# EAGLE schematic teensy3.6-cs42448 (EAGLE 9.3.2)

## Sheet 1 of 2
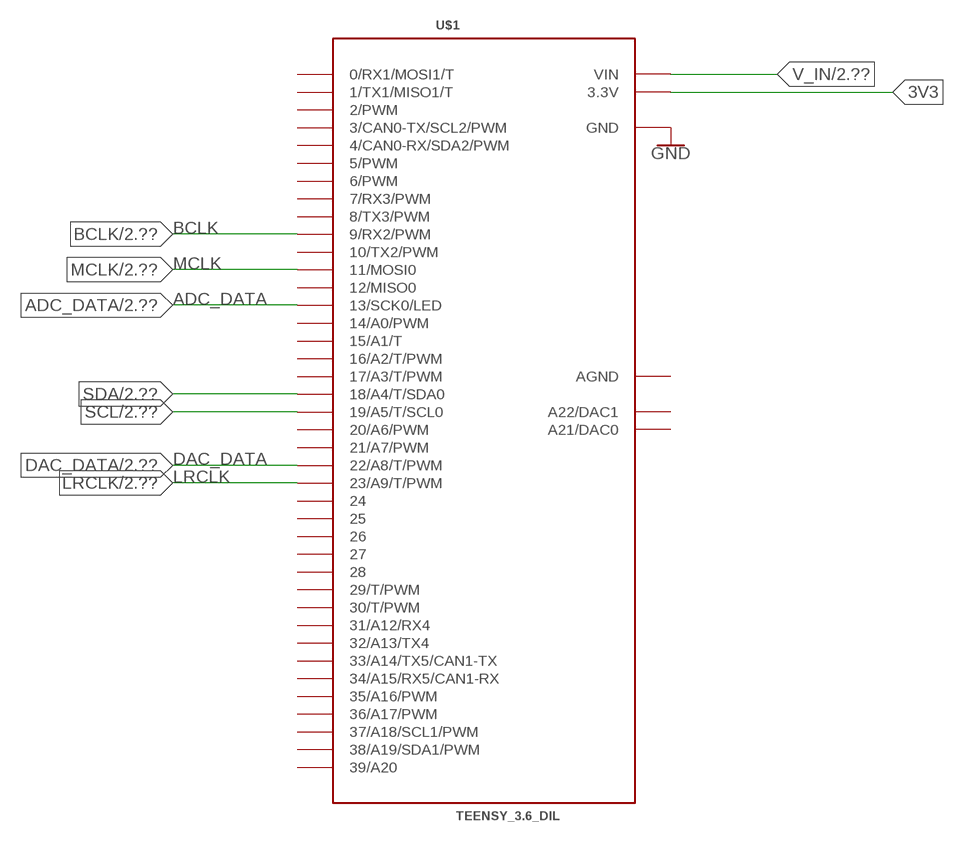
[diagram p0: schematic, sheet 1]

### Parts
U$1  TEENSY_3.6_DIL  [TEENSY_3.6_DIL]

### Nets
3V3: U$1.3.3V U$1.3.3V3(3.3V) ; also sheet 2
ADC_DATA: U$1.13(13/SCK0/LED) ; also sheet 2
BCLK: U$1.9(9/RX2/PWM) ; also sheet 2
DAC_DATA: U$1.22/A8(22/A8/T/PWM) ; also sheet 2
GND: U$1.GND U$1.GND1(GND) ; also sheet 2
LRCLK: U$1.23/A9(23/A9/T/PWM) ; also sheet 2
MCLK: U$1.11(11/MOSI0) ; also sheet 2
SCL: U$1.19/A5(19/A5/T/SCL0) ; also sheet 2
SDA: U$1.18/A4(18/A4/T/SDA0) ; also sheet 2
V_IN: U$1.VIN ; also sheet 2
Unconnected: U$1.0(0/RX1/MOSI1/T) U$1.1(1/TX1/MISO1/T) U$1.2(2/PWM) U$1.3(3/CAN0-TX/SCL2/PWM) U$1.4(4/CAN0-RX/SDA2/PWM) U$1.5(5/PWM) U$1.6(6/PWM) U$1.7(7/RX3/PWM) U$1.8(8/TX3/PWM) U$1.10(10/TX2/PWM) U$1.12(12/MISO0) U$1.14/A0(14/A0/PWM) U$1.15/A1(15/A1/T) U$1.16/A2(16/A2/T/PWM) U$1.17/A3(17/A3/T/PWM) U$1.20/A6(20/A6/PWM) U$1.21/A7(21/A7/PWM) U$1.24 U$1.25 U$1.26 U$1.27 U$1.28 U$1.29(29/T/PWM) U$1.30(30/T/PWM) U$1.31/A12(31/A12/RX4) U$1.32/A13(32/A13/TX4) U$1.33/A14(33/A14/TX5/CAN1-TX) U$1.34/A15(34/A15/RX5/CAN1-RX) U$1.35/A16(35/A16/PWM) U$1.36/A17(36/A17/PWM) U$1.37/A18(37/A18/SCL1/PWM) U$1.38/A19(38/A19/SDA1/PWM) U$1.39/A20 U$1.A21(A21/DAC0) U$1.A22(A22/DAC1)

## Sheet 2 of 2
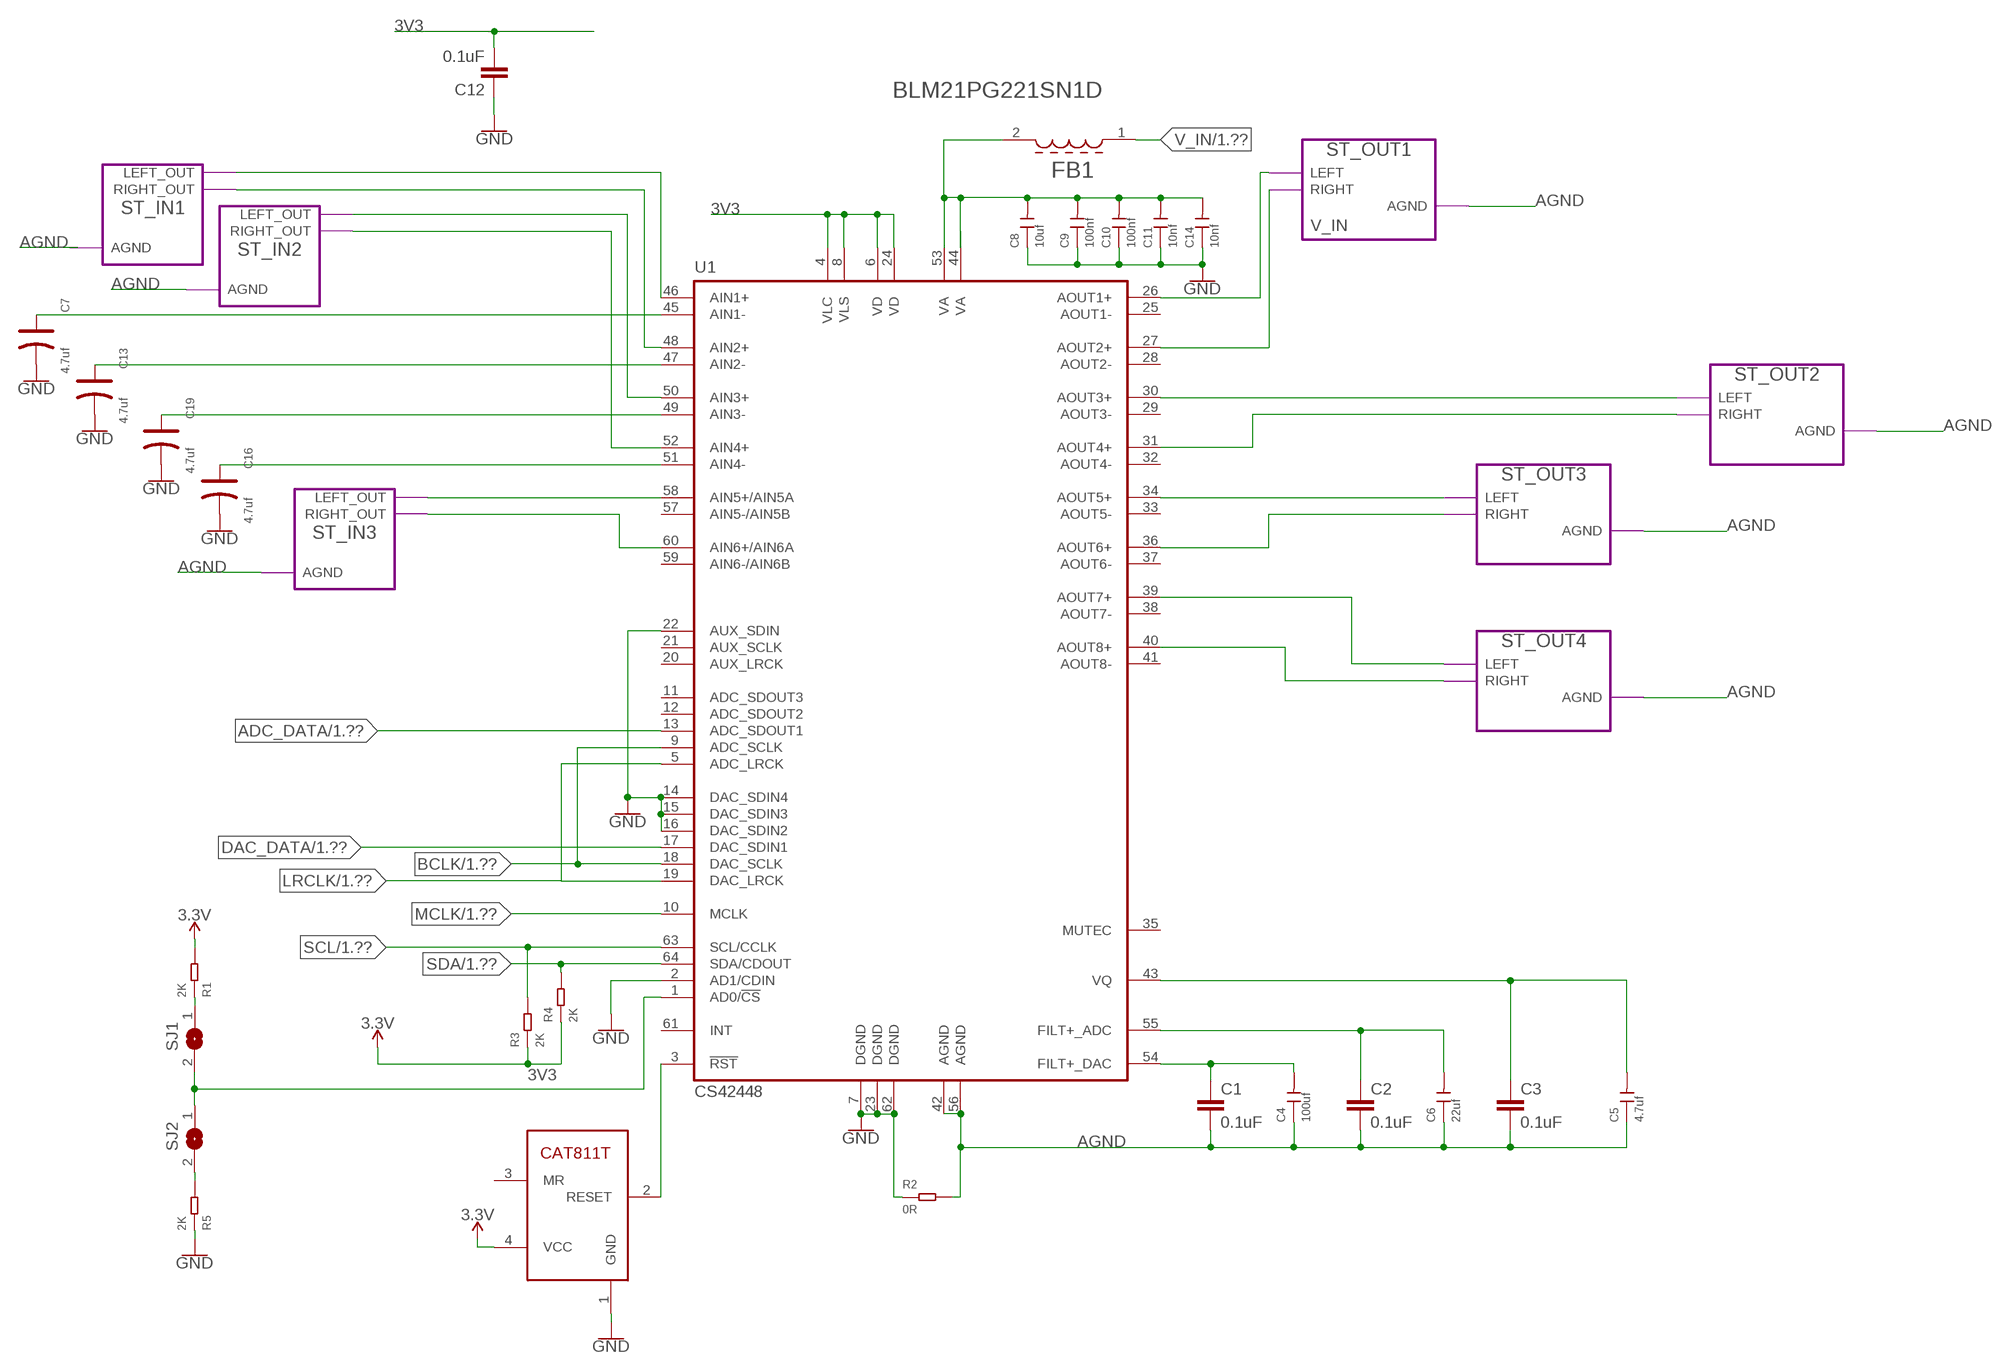
[diagram p1: schematic, sheet 2]

### Parts
C1  0.1uF  0.1UF-0603-25V-5%  [0603]
C2  0.1uF  0.1UF-0603-25V-5%  [0603]
C3  0.1uF  0.1UF-0603-25V-5%  [0603]
C4  100uf  CERAMIC-100UF-6.3V-20%-X5R(1206)  [C1206]
C5  4.7uf  CERAMIC-4.7UF-25V-10%-X5R(0805)  [C0805]
C6  22uf  CERAMIC-22UF-6.3V-20%-X5R(0805)  [C0805]
C7  4.7uf  TANTALUM-SMD-4.7UF-16V(AVX-A)  [AVX-A]
C8  10uf  CERAMIC-10UF-25V-10%-X5R(0805)  [C0805]
C9  100nf  CERAMIC-100NF-50V-10%-X7R(0805)  [C0805]
C10  100nf  CERAMIC-100NF-50V-10%-X7R(0805)  [C0805]
C11  10nf  CERAMIC-10NF-50V-5%-X7R(0805)  [C0805]
C12  0.1uF  0.1UF-0603-25V-5%  [0603]
C13  4.7uf  TANTALUM-SMD-4.7UF-16V(AVX-A)  [AVX-A]
C14  10nf  CERAMIC-10NF-50V-5%-X7R(0805)  [C0805]
C16  4.7uf  TANTALUM-SMD-4.7UF-16V(AVX-A)  [AVX-A]
C19  4.7uf  TANTALUM-SMD-4.7UF-16V(AVX-A)  [AVX-A]
FB1  MURATA_BLM21PG221SN1DMURATA_BLM21PG221SN1D_0_1  [MURATA_BLM21PG221SN1D_1]
R1  2K  SMD-RES-2K-5%-1/10W(0603)  [R0603]
R2  0R  ZERO-OHM-LINK  [R0805]
R3  2K  SMD-RES-2K-5%-1/10W(0603)  [R0603]
R4  2K  SMD-RES-2K-5%-1/10W(0603)  [R0603]
R5  2K  SMD-RES-2K-5%-1/10W(0603)  [R0603]
SJ1  SJ  [SJ]
SJ2  SJ  [SJ]
U1  CS42448  [LQFP64L]
U$2  CAT811T  [SOT143]

### Module instances
ST_IN1 = STEREO_IN
ST_IN2 = STEREO_IN
ST_IN3 = STEREO_IN
ST_OUT1 = STEREO_OUT
ST_OUT2 = STEREO_OUT
ST_OUT3 = STEREO_OUT
ST_OUT4 = STEREO_OUT

### Nets
3.3V: R1.2 U$2.4(VCC)
3V3: C12.2 R3.1 R4.1 U1.4(VLC) U1.6(VD) U1.8(VLS) U1.24(VD) ; supply symbol labelled 3.3V ; also sheet 1
ADC_DATA: U1.13(ADC_SDOUT1) ; also sheet 1
AGND: C1.2 C2.2 C3.2 C4.1 C5.1 C6.1 R2.2 U1.42(AGND) U1.56(AGND) ; port ST_OUT1.AGND ST_IN2.AGND ST_IN3.AGND ST_OUT2.AGND ST_OUT3.AGND ST_OUT4.AGND
BCLK: U1.9(ADC_SCLK) U1.18(DAC_SCLK) ; also sheet 1
DAC_DATA: U1.17(DAC_SDIN1) ; also sheet 1
GND: C7.- C8.1 C9.1 C10.1 C11.1 C12.1 C13.- C14.1 C16.- C19.- R2.1 R5.1 U1.2(AD1/CDIN) U1.7(DGND) U1.14(DAC_SDIN4) U1.15(DAC_SDIN3) U1.16(DAC_SDIN2) U1.22(AUX_SDIN) U1.23(DGND) U1.62(DGND) U$2.1(GND) ; also sheet 1
LRCLK: U1.5(ADC_LRCK) U1.19(DAC_LRCK) ; also sheet 1
MCLK: U1.10(MCLK) ; also sheet 1
N$1: U1.46(AIN1+) ; port ST_IN1.LEFT_OUT
N$2: C1.1 C4.2 U1.54(FILT+_DAC)
N$3: C2.1 C6.2 U1.55(FILT+_ADC)
N$4: C3.1 C5.2 U1.43(VQ)
N$5: U1.48(AIN2+) ; port ST_IN1.RIGHT_OUT
N$6: C8.2 C9.2 C10.2 C11.2 C14.2 FB1.2 U1.44(VA) U1.53(VA)
N$7: U1.58(AIN5+/AIN5A) ; port ST_IN3.LEFT_OUT
N$8: C7.+ U1.45(AIN1-)
N$9: C13.+ U1.47(AIN2-)
N$10: U1.60(AIN6+/AIN6A) ; port ST_IN3.RIGHT_OUT
N$11: SJ1.2 SJ2.1 U1.1(AD0/!CS!)
N$12: R1.1 SJ1.1
N$13: U1.52(AIN4+) ; port ST_IN2.RIGHT_OUT
N$14: U1.50(AIN3+) ; port ST_IN2.LEFT_OUT
N$15: U1.26(AOUT1+) ; port ST_OUT1.LEFT
N$16: C16.+ U1.51(AIN4-)
N$17: U1.27(AOUT2+) ; port ST_OUT1.RIGHT
N$18: U1.30(AOUT3+) ; port ST_OUT2.LEFT
N$19: U1.31(AOUT4+) ; port ST_OUT2.RIGHT
N$20: C19.+ U1.49(AIN3-)
N$21: U1.34(AOUT5+) ; port ST_OUT3.LEFT
N$22: U1.36(AOUT6+) ; port ST_OUT3.RIGHT
N$23: U1.39(AOUT7+) ; port ST_OUT4.LEFT
N$24: U1.40(AOUT8+) ; port ST_OUT4.RIGHT
N$25: R5.2 SJ2.2
N$26: U1.3(!RST!) U$2.2(RESET)
SCL: R3.2 U1.63(SCL/CCLK) ; also sheet 1
SDA: R4.2 U1.64(SDA/CDOUT) ; also sheet 1
V_IN: FB1.1 ; also sheet 1
Unconnected: U1.11(ADC_SDOUT3) U1.12(ADC_SDOUT2) U1.20(AUX_LRCK) U1.21(AUX_SCLK) U1.25(AOUT1-) U1.28(AOUT2-) U1.29(AOUT3-) U1.32(AOUT4-) U1.33(AOUT5-) U1.35(MUTEC) U1.37(AOUT6-) U1.38(AOUT7-) U1.41(AOUT8-) U1.57(AIN5-/AIN5B) U1.59(AIN6-/AIN6B) U1.61(INT) U$2.3(MR)

## Power pins joined to a net without a drawn wire
AGND: U$1.AGND

## Library data of the parts
C1-C3 C12 = SparkFun-Capacitors:0.1UF: 0.1µF ceramic capacitors A capacitor is a passive two-terminal electrical component used to store electrical energy temporarily in an electric field.; PROD_ID: CAP-08604
C4 = Seeed-Capacitor:CERAMIC-100UF-6.3V-20%-X5R(1206): 302010183; MPN: GRM31CR60J107ME39L
C5 = Seeed-Capacitor:CERAMIC-4.7UF-25V-10%-X5R(0805): 302010146; MPN: CC0805KKX5R8BB475
C6 = Seeed-Capacitor:CERAMIC-22UF-6.3V-20%-X5R(0805): 302010171; MPN: CC0805MKX5R5BB226
C7 C13 C16 C19 = Seeed-Capacitor:TANTALUM-SMD-4.7UF-16V(AVX-A): 302020006; MPN: TAJA475*016#NJ
C8 = Seeed-Capacitor:CERAMIC-10UF-25V-10%-X5R(0805): 302010178; MPN: CC0805KKX5R8BB106
C9 C10 = Seeed-Capacitor:CERAMIC-100NF-50V-10%-X7R(0805): 302010165; MPN: CC0805KRX7R9BB104
C11 C14 = Seeed-Capacitor:CERAMIC-10NF-50V-5%-X7R(0805): 302010175; MPN: CC0805JRX7R9BB103
FB1 = Murata - BLM21PG221SN1D:MURATA_BLM21PG221SN1D: MURA-FB-2; CIIVA_IDS: 886556; COMPONENT_LINK_1_DESCRIPTION: Manufacturer URL; COMPONENT_LINK_1_URL: http://www.murata.com/; COMPONENT_LINK_3_DESCRIPTION: Package Specification; COMPONENT_LINK_3_URL: http://www.murata.com/products/catalog/pdf/c31e.pdf; DATASHEET: http://www.murata.com/products/catalog/pdf/c31e.pdf; DATASHEET_VERSION: 08/2013; DC_RESISTANCE: 0.045 Ohm Max.; FOOTPRINT_VARIANT_NAME_0: MURA-BLM21-B20-CHIP-2_V2; FOOTPRINT_VARIANT_NAME_1: MURA-BLM21-B20-CHIP-2_V1; IMPEDANCE_AT_100_MHZ: 220 Ohm +/- 25%; IMPORTED: yes; IMPORTED_FROM: vault; IMPORT_TS: 1521843617; MF: Murata; MOUNTING_TECHNOLOGY: Surface Mount; MPN: BLM21PG221SN1D; OPERATING_TEMPERATURE_RANGE: -55 to 125 degC; PACKAGE: BLM21_H1050-2; PACKAGE_DESCRIPTION: 2-Pin Chip, Body 2 x 1.25 mm; PACKING: Tape and Reel; PREFIX: FB; RATED_CURRENT: 2000 mA; RELEASE_DATE: 1390571351; VAULT_GUID: D6414E20-2109-4A17-A638-53E055BFA7B6; VAULT_REVISION: E9EAA9AD-C8DD-4E35-B9CB-2397DCCBD7BA
R1 R3-R5 = OPL_Resistor:SMD-RES-2K-5%-1/10W(0603): 301010113; MPN: RC0603JR-072KL
R2 = zero-ohm-resistor:ZERO-OHM-LINK: 301010264; MPN: RL0805JR-070R1L; VALUE: 0.1R
SJ1 SJ2 = jumper:SJ: SMD solder JUMPER
U1 = cirrus:CS42448: CODEC 6-In, 8-Out, 108 dB, 192 kHz
U$1 = Teensy_3_and_LC_Series_Boards_v1.4:TEENSY_3.6_DIL: Teensy 3.6 DIL Package
U$2 = CAT811T:CAT811T

## Module STEREO_IN
Ports: LEFT_OUT(out) RIGHT_OUT(out) AGND(out)
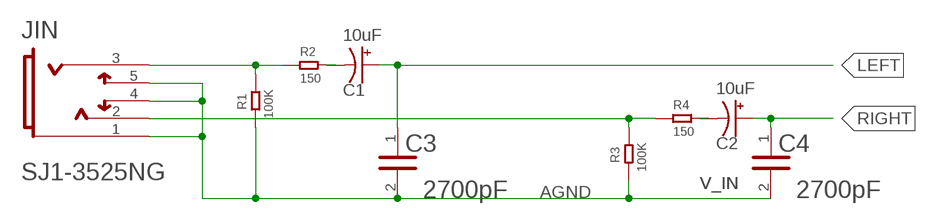
[diagram p2: schematic, module STEREO_IN, sheet 1]

### Parts
C1  10uF  10UF-POLAR-0603-6.3V-20%(TANT)  [0603-POLAR]
C2  10uF  10UF-POLAR-0603-6.3V-20%(TANT)  [0603-POLAR]
C3  MURATA_GRM2165C1H272JA01DMURATA_GRM2165C1H272JA01D_0_1  [MURATA_GRM2165C1H272JA01D_1]
C4  MURATA_GRM2165C1H272JA01DMURATA_GRM2165C1H272JA01D_0_1  [MURATA_GRM2165C1H272JA01D_1]
JIN  CUI_SJ1-3525NGCUI_SJ1-3525NG_0_0  [CUI_SJ1-3525NG_0]
R1  100K  SMD-RES-100K-1%-1/8W(0805)  [R0805]
R2  150  SMD-RES-150R-1%-1/8W(0805)  [R0805]
R3  100K  SMD-RES-100K-1%-1/8W(0805)  [R0805]
R4  150  SMD-RES-150R-1%-1/8W(0805)  [R0805]

### Nets
AGND: C3.2 C4.2 JIN.1(SLEEVE) JIN.4(TIP_SWITCH) JIN.5(RING_SWITCH) R1.1 R3.1
LEFT: C1.+ C3.1
N$1: JIN.3(RING) R1.2 R2.1
N$7: C1.- R2.2
N$10: JIN.2(TIP) R3.2 R4.1
N$11: C2.- R4.2
RIGHT: C2.+ C4.1

### Library data of the parts
C1 C2 = SparkFun-Capacitors:10UF-POLAR: 10.0µF polarized capacitors A capacitor is a passive two-terminal electrical component used to store electrical energy temporarily in an electric field.; PROD_ID: CAP-13210
C3 C4 = Murata - GRM2165C1H272JA01D:MURATA_GRM2165C1H272JA01D: CAP Ceramic 2700pF 5% C0G 50V 0805 SMD; CAPACITANCE: 2700pF; CENTROID_NOT_SPECIFIED: No; DATASHEET: http://search.murata.co.jp/Ceramy/image/img/A01X/G101/ENG/GRM21BC71H475KE11-01.pdf; DEVICE_CLASS_L1: Passive Components; DEVICE_CLASS_L2: Capacitors; DEVICE_CLASS_L3: Ceramic Capacitors; DIGIKEY_DESCRIPTION: CAP CER 2700PF 50V C0G/NP0 0805; DIGIKEY_PART_NUMBER: 490-1630-2-ND; FOOTPRINT_PARAMETERS_0: {"fp_type":"chip_cap","params":{"L":{"nom":2000000,"long name":"Length","min":1800000,"max":2200000,"short name":"L","type":"measurement"},"W":{"nom":1250000,"long name":"Width","min":1049999,"max":1450000,"short name":"W","type":"measurement"},"t":{"nom":1250000,"long name":"Height","min":1049999,"max":1450000,"short name":"t","type":"measurement"},"b":{"nom":false,"long name":"Terminal width","min":200000,"max":700000,"short name":"b","type":"measurement"},"P":{"default":"false","long name":"Polarized","type":"multichoice","short name":"P"},"offset x":{"nom":0,"long name":"X Center offset","min":null,"max":null,"short name":"offset x","type":"measurement"},"offset y":{"nom":0,"long name":"Y Center offset","min":null,"max":null,"short name":"offset y","type":"measurement"},"POL":{"default":"No","long name":"Pin 1 polarity marker","type":"multichoice","short name":"POL"},"LS":{"long name":"Land shape","type":"fixed","short name":"LS","value":"Rectangle"},"solder toe":{"nom":550000,"long name":"Solder fillet (toe)","min":null,"max":null,"short name":"solder toe","type":"fixedmeasurement"},"solder heel":{"nom":-50000,"long name":"Solder fillet (heel)","min":null,"max":null,"short name":"solder heel","type":"fixedmeasurement"},"solder side":{"nom":50000,"long name":"Solder fillet (side)","min":null,"max":null,"short name":"solder side","type":"fixedmeasurement"},"courtyard":{"nom":500000,"long name":"Courtyard","min":null,"max":null,"short name":"courtyard","type":"fixedmeasurement"},"SF":{"default":"A (>= 1608 metric)","long name":"Packing level","type":"multichoiceparent","short name":"SF","help":"http://support.upverter.com/customer/portal/articles/978783-what-is-a-footprint-packing-level","children":["solder toe","solder heel","solder side","courtyard"]}}}; FOOTPRINT_PARAMETERS_1: {"fp_type":"chip_cap","params":{"L":{"nom":2000000,"long name":"Length","min":1800000,"max":2200000,"short name":"L","type":"measurement"},"W":{"nom":1250000,"long name":"Width","min":1049999,"max":1450000,"short name":"W","type":"measurement"},"t":{"nom":1250000,"long name":"Height","min":1049999,"max":1450000,"short name":"t","type":"measurement"},"b":{"nom":false,"long name":"Terminal width","min":200000,"max":700000,"short name":"b","type":"measurement"},"P":{"default":"false","long name":"Polarized","type":"multichoice","short name":"P"},"offset x":{"nom":0,"long name":"X Center offset","min":null,"max":null,"short name":"offset x","type":"measurement"},"offset y":{"nom":0,"long name":"Y Center offset","min":null,"max":null,"short name":"offset y","type":"measurement"},"POL":{"default":"No","long name":"Pin 1 polarity marker","type":"multichoice","short name":"POL"},"LS":{"long name":"Land shape","type":"fixed","short name":"LS","value":"Rectangle"},"solder toe":{"nom":350000,"long name":"Solder fillet (toe)","min":null,"max":null,"short name":"solder toe","type":"fixedmeasurement"},"solder heel":{"nom":-50000,"long name":"Solder fillet (heel)","min":null,"max":null,"short name":"solder heel","type":"fixedmeasurement"},"solder side":{"nom":0,"long name":"Solder fillet (side)","min":null,"max":null,"short name":"solder side","type":"fixedmeasurement"},"courtyard":{"nom":250000,"long name":"Courtyard","min":null,"max":null,"short name":"courtyard","type":"fixedmeasurement"},"SF":{"default":"B (>= 1608 metric)","long name":"Packing level","type":"multichoiceparent","short name":"SF","help":"http://support.upverter.com/customer/portal/articles/978783-what-is-a-footprint-packing-level","children":["solder toe","solder heel","solder side","courtyard"]}}}; FOOTPRINT_PARAMETERS_2: {"fp_type":"chip_cap","params":{"L":{"nom":2000000,"long name":"Length","min":1800000,"max":2200000,"short name":"L","type":"measurement"},"W":{"nom":1250000,"long name":"Width","min":1049999,"max":1450000,"short name":"W","type":"measurement"},"t":{"nom":1250000,"long name":"Height","min":1049999,"max":1450000,"short name":"t","type":"measurement"},"b":{"nom":false,"long name":"Terminal width","min":200000,"max":700000,"short name":"b","type":"measurement"},"P":{"default":"false","long name":"Polarized","type":"multichoice","short name":"P"},"offset x":{"nom":0,"long name":"X Center offset","min":null,"max":null,"short name":"offset x","type":"measurement"},"offset y":{"nom":0,"long name":"Y Center offset","min":null,"max":null,"short name":"offset y","type":"measurement"},"POL":{"default":"No","long name":"Pin 1 polarity marker","type":"multichoice","short name":"POL"},"LS":{"long name":"Land shape","type":"fixed","short name":"LS","value":"Rectangle"},"solder toe":{"nom":150000,"long name":"Solder fillet (toe)","min":null,"max":null,"short name":"solder toe","type":"fixedmeasurement"},"solder heel":{"nom":-50000,"long name":"Solder fillet (heel)","min":null,"max":null,"short name":"solder heel","type":"fixedmeasurement"},"solder side":{"nom":-50000,"long name":"Solder fillet (side)","min":null,"max":null,"short name":"solder side","type":"fixedmeasurement"},"courtyard":{"nom":100000,"long name":"Courtyard","min":null,"max":null,"short name":"courtyard","type":"fixedmeasurement"},"SF":{"default":"C (>= 1608 metric)","long name":"Packing level","type":"multichoiceparent","short name":"SF","help":"http://support.upverter.com/customer/portal/articles/978783-what-is-a-footprint-packing-level","children":["solder toe","solder heel","solder side","courtyard"]}}}; FOOTPRINT_VARIANT_NAME_0: IPC_A; FOOTPRINT_VARIANT_NAME_1: IPC_B; FOOTPRINT_VARIANT_NAME_2: IPC_C; FOOTPRINT_VARIANT_NAME_3: Recommended_Land_Pattern; HEIGHT: 1.45mm; IPC_LAND_PATTERN_NAME: CAPC200125X125; LEAD_FREE: yes; MATERIAL: Ceramic; MF: Murata; MFG_PACKAGE_IDENT: GRM21; MFG_PACKAGE_IDENT_DATE: 0; MFG_PACKAGE_IDENT_REV: 0; MOUSER_DESCRIPTION: Multilayer Ceramic Capacitors MLCC - SMD/SMT 0805 2700pF 50volts C0G 5%; MOUSER_PART_NUMBER: 81-GRM2165C1H272JA01; MPN: GRM2165C1H272JA01D; PACKAGE: 0805 (2012 metric); PREFIX: C; ROHS: yes; STANDOFF_HEIGHT: 0mm; TEMPERATURE_CHARACTERISTIC: C0G; TEMPERATURE_RANGE_HIGH: +125°C; TEMPERATURE_RANGE_LOW: -55°C; TOLERANCE: 5%; VERIFICATION_VERSION: 0.0.0.1; VOLTAGE_RATING: 50V
JIN = CUI - SJ1-3525NG:CUI_SJ1-3525NG: 3.5mm Connector, Tip/Ring switches, PTH; CENTROID_NOT_SPECIFIED: No; COLOR: Black; DATASHEET: http://datasheet.octopart.com/SJ1-3525NG-CUI-datasheet-15696621.pdf; DIGIKEY_DESCRIPTION: CONN JACK STEREO 3.5MM R/A; DIGIKEY_PART_NUMBER: CP1-3525NG-ND; GENDER: Female; IMPORTED_FROM: octopart; LEAD_FREE: yes; MF: CUI; MOUNTING_ANGLE: 90 °; MOUNTING_TYPE: through hole; MOUSER_PART_NUMBER: 490-SJ1-3525NG; MPN: SJ1-3525NG; NUM_PINS: 5; OCTOPART_PART_NUMBER: 860d4f04c91d59ca; PACKAGE: CONN_PTH_12MM0_14MM0_JACK; PREFIX: J; ROHS: yes; SIZE_DIAMETER: 3.5 mm; TEMPERATURE_RANGE_HIGH: +85°C; TEMPERATURE_RANGE_LOW: -40°C
R1 R3 = OPL_Resistor:SMD-RES-100K-1%-1/8W(0805): 301012150; MPN: RC0805JR-071KL; VALUE: 1K
R2 R4 = OPL_Resistor:SMD-RES-150R-1%-1/8W(0805): 301012154; MPN: RC0805JR-071KL; VALUE: 1K

## Module STEREO_OUT
Ports: LEFT(out) RIGHT(out) AGND(out)
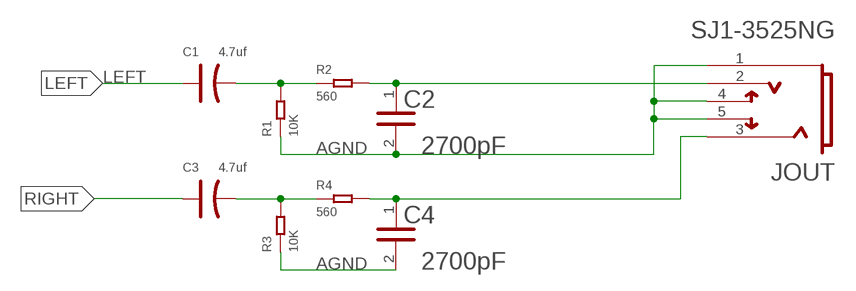
[diagram p3: schematic, module STEREO_OUT, sheet 1]

### Parts
C1  4.7uf  TANTALUM-SMD-4.7UF-16V(AVX-A)  [AVX-A]
C2  MURATA_GRM2165C1H272JA01DMURATA_GRM2165C1H272JA01D_0_1  [MURATA_GRM2165C1H272JA01D_1]
C3  4.7uf  TANTALUM-SMD-4.7UF-16V(AVX-A)  [AVX-A]
C4  MURATA_GRM2165C1H272JA01DMURATA_GRM2165C1H272JA01D_0_1  [MURATA_GRM2165C1H272JA01D_1]
JOUT  CUI_SJ1-3525NGCUI_SJ1-3525NG_0_0  [CUI_SJ1-3525NG_0]
R1  10K  SMD-RES-10K-1%-1/8W(0805)  [R0805]
R2  560  SMD-RES-560R-1%-1/8W(0805)  [R0805]
R3  10K  SMD-RES-10K-1%-1/8W(0805)  [R0805]
R4  560  SMD-RES-560R-1%-1/8W(0805)  [R0805]

### Nets
AGND: C2.2 C4.2 JOUT.1(SLEEVE) JOUT.4(TIP_SWITCH) JOUT.5(RING_SWITCH) R1.1 R3.1
LEFT: C1.+
N$1: C3.- R3.2 R4.1
N$2: C4.1 JOUT.3(RING) R4.2
N$3: C2.1 JOUT.2(TIP) R2.2
N$17: C1.- R1.2 R2.1
RIGHT: C3.+

### Library data of the parts
C1 C3 = Seeed-Capacitor:TANTALUM-SMD-4.7UF-16V(AVX-A): 302020006; MPN: TAJA475*016#NJ
C2 C4 = Murata - GRM2165C1H272JA01D:MURATA_GRM2165C1H272JA01D: CAP Ceramic 2700pF 5% C0G 50V 0805 SMD; CAPACITANCE: 2700pF; CENTROID_NOT_SPECIFIED: No; DATASHEET: http://search.murata.co.jp/Ceramy/image/img/A01X/G101/ENG/GRM21BC71H475KE11-01.pdf; DEVICE_CLASS_L1: Passive Components; DEVICE_CLASS_L2: Capacitors; DEVICE_CLASS_L3: Ceramic Capacitors; DIGIKEY_DESCRIPTION: CAP CER 2700PF 50V C0G/NP0 0805; DIGIKEY_PART_NUMBER: 490-1630-2-ND; FOOTPRINT_PARAMETERS_0: {"fp_type":"chip_cap","params":{"L":{"nom":2000000,"long name":"Length","min":1800000,"max":2200000,"short name":"L","type":"measurement"},"W":{"nom":1250000,"long name":"Width","min":1049999,"max":1450000,"short name":"W","type":"measurement"},"t":{"nom":1250000,"long name":"Height","min":1049999,"max":1450000,"short name":"t","type":"measurement"},"b":{"nom":false,"long name":"Terminal width","min":200000,"max":700000,"short name":"b","type":"measurement"},"P":{"default":"false","long name":"Polarized","type":"multichoice","short name":"P"},"offset x":{"nom":0,"long name":"X Center offset","min":null,"max":null,"short name":"offset x","type":"measurement"},"offset y":{"nom":0,"long name":"Y Center offset","min":null,"max":null,"short name":"offset y","type":"measurement"},"POL":{"default":"No","long name":"Pin 1 polarity marker","type":"multichoice","short name":"POL"},"LS":{"long name":"Land shape","type":"fixed","short name":"LS","value":"Rectangle"},"solder toe":{"nom":550000,"long name":"Solder fillet (toe)","min":null,"max":null,"short name":"solder toe","type":"fixedmeasurement"},"solder heel":{"nom":-50000,"long name":"Solder fillet (heel)","min":null,"max":null,"short name":"solder heel","type":"fixedmeasurement"},"solder side":{"nom":50000,"long name":"Solder fillet (side)","min":null,"max":null,"short name":"solder side","type":"fixedmeasurement"},"courtyard":{"nom":500000,"long name":"Courtyard","min":null,"max":null,"short name":"courtyard","type":"fixedmeasurement"},"SF":{"default":"A (>= 1608 metric)","long name":"Packing level","type":"multichoiceparent","short name":"SF","help":"http://support.upverter.com/customer/portal/articles/978783-what-is-a-footprint-packing-level","children":["solder toe","solder heel","solder side","courtyard"]}}}; FOOTPRINT_PARAMETERS_1: {"fp_type":"chip_cap","params":{"L":{"nom":2000000,"long name":"Length","min":1800000,"max":2200000,"short name":"L","type":"measurement"},"W":{"nom":1250000,"long name":"Width","min":1049999,"max":1450000,"short name":"W","type":"measurement"},"t":{"nom":1250000,"long name":"Height","min":1049999,"max":1450000,"short name":"t","type":"measurement"},"b":{"nom":false,"long name":"Terminal width","min":200000,"max":700000,"short name":"b","type":"measurement"},"P":{"default":"false","long name":"Polarized","type":"multichoice","short name":"P"},"offset x":{"nom":0,"long name":"X Center offset","min":null,"max":null,"short name":"offset x","type":"measurement"},"offset y":{"nom":0,"long name":"Y Center offset","min":null,"max":null,"short name":"offset y","type":"measurement"},"POL":{"default":"No","long name":"Pin 1 polarity marker","type":"multichoice","short name":"POL"},"LS":{"long name":"Land shape","type":"fixed","short name":"LS","value":"Rectangle"},"solder toe":{"nom":350000,"long name":"Solder fillet (toe)","min":null,"max":null,"short name":"solder toe","type":"fixedmeasurement"},"solder heel":{"nom":-50000,"long name":"Solder fillet (heel)","min":null,"max":null,"short name":"solder heel","type":"fixedmeasurement"},"solder side":{"nom":0,"long name":"Solder fillet (side)","min":null,"max":null,"short name":"solder side","type":"fixedmeasurement"},"courtyard":{"nom":250000,"long name":"Courtyard","min":null,"max":null,"short name":"courtyard","type":"fixedmeasurement"},"SF":{"default":"B (>= 1608 metric)","long name":"Packing level","type":"multichoiceparent","short name":"SF","help":"http://support.upverter.com/customer/portal/articles/978783-what-is-a-footprint-packing-level","children":["solder toe","solder heel","solder side","courtyard"]}}}; FOOTPRINT_PARAMETERS_2: {"fp_type":"chip_cap","params":{"L":{"nom":2000000,"long name":"Length","min":1800000,"max":2200000,"short name":"L","type":"measurement"},"W":{"nom":1250000,"long name":"Width","min":1049999,"max":1450000,"short name":"W","type":"measurement"},"t":{"nom":1250000,"long name":"Height","min":1049999,"max":1450000,"short name":"t","type":"measurement"},"b":{"nom":false,"long name":"Terminal width","min":200000,"max":700000,"short name":"b","type":"measurement"},"P":{"default":"false","long name":"Polarized","type":"multichoice","short name":"P"},"offset x":{"nom":0,"long name":"X Center offset","min":null,"max":null,"short name":"offset x","type":"measurement"},"offset y":{"nom":0,"long name":"Y Center offset","min":null,"max":null,"short name":"offset y","type":"measurement"},"POL":{"default":"No","long name":"Pin 1 polarity marker","type":"multichoice","short name":"POL"},"LS":{"long name":"Land shape","type":"fixed","short name":"LS","value":"Rectangle"},"solder toe":{"nom":150000,"long name":"Solder fillet (toe)","min":null,"max":null,"short name":"solder toe","type":"fixedmeasurement"},"solder heel":{"nom":-50000,"long name":"Solder fillet (heel)","min":null,"max":null,"short name":"solder heel","type":"fixedmeasurement"},"solder side":{"nom":-50000,"long name":"Solder fillet (side)","min":null,"max":null,"short name":"solder side","type":"fixedmeasurement"},"courtyard":{"nom":100000,"long name":"Courtyard","min":null,"max":null,"short name":"courtyard","type":"fixedmeasurement"},"SF":{"default":"C (>= 1608 metric)","long name":"Packing level","type":"multichoiceparent","short name":"SF","help":"http://support.upverter.com/customer/portal/articles/978783-what-is-a-footprint-packing-level","children":["solder toe","solder heel","solder side","courtyard"]}}}; FOOTPRINT_VARIANT_NAME_0: IPC_A; FOOTPRINT_VARIANT_NAME_1: IPC_B; FOOTPRINT_VARIANT_NAME_2: IPC_C; FOOTPRINT_VARIANT_NAME_3: Recommended_Land_Pattern; HEIGHT: 1.45mm; IPC_LAND_PATTERN_NAME: CAPC200125X125; LEAD_FREE: yes; MATERIAL: Ceramic; MF: Murata; MFG_PACKAGE_IDENT: GRM21; MFG_PACKAGE_IDENT_DATE: 0; MFG_PACKAGE_IDENT_REV: 0; MOUSER_DESCRIPTION: Multilayer Ceramic Capacitors MLCC - SMD/SMT 0805 2700pF 50volts C0G 5%; MOUSER_PART_NUMBER: 81-GRM2165C1H272JA01; MPN: GRM2165C1H272JA01D; PACKAGE: 0805 (2012 metric); PREFIX: C; ROHS: yes; STANDOFF_HEIGHT: 0mm; TEMPERATURE_CHARACTERISTIC: C0G; TEMPERATURE_RANGE_HIGH: +125°C; TEMPERATURE_RANGE_LOW: -55°C; TOLERANCE: 5%; VERIFICATION_VERSION: 0.0.0.1; VOLTAGE_RATING: 50V
JOUT = CUI - SJ1-3525NG:CUI_SJ1-3525NG: 3.5mm Connector, Tip/Ring switches, PTH; CENTROID_NOT_SPECIFIED: No; COLOR: Black; DATASHEET: http://datasheet.octopart.com/SJ1-3525NG-CUI-datasheet-15696621.pdf; DIGIKEY_DESCRIPTION: CONN JACK STEREO 3.5MM R/A; DIGIKEY_PART_NUMBER: CP1-3525NG-ND; GENDER: Female; IMPORTED_FROM: octopart; LEAD_FREE: yes; MF: CUI; MOUNTING_ANGLE: 90 °; MOUNTING_TYPE: through hole; MOUSER_PART_NUMBER: 490-SJ1-3525NG; MPN: SJ1-3525NG; NUM_PINS: 5; OCTOPART_PART_NUMBER: 860d4f04c91d59ca; PACKAGE: CONN_PTH_12MM0_14MM0_JACK; PREFIX: J; ROHS: yes; SIZE_DIAMETER: 3.5 mm; TEMPERATURE_RANGE_HIGH: +85°C; TEMPERATURE_RANGE_LOW: -40°C
R1 R3 = OPL_Resistor:SMD-RES-10K-1%-1/8W(0805): 301012152; MPN: RC0805FR-0710KL
R2 R4 = OPL_Resistor:SMD-RES-560R-1%-1/8W(0805): 301012178; MPN: RC0805JR-071KL; VALUE: 1K